# EAGLE design TEENSY AUDIO BOARDS (EAGLE 9.4.1)

## Sheet 1 of 2: IO Conditioning
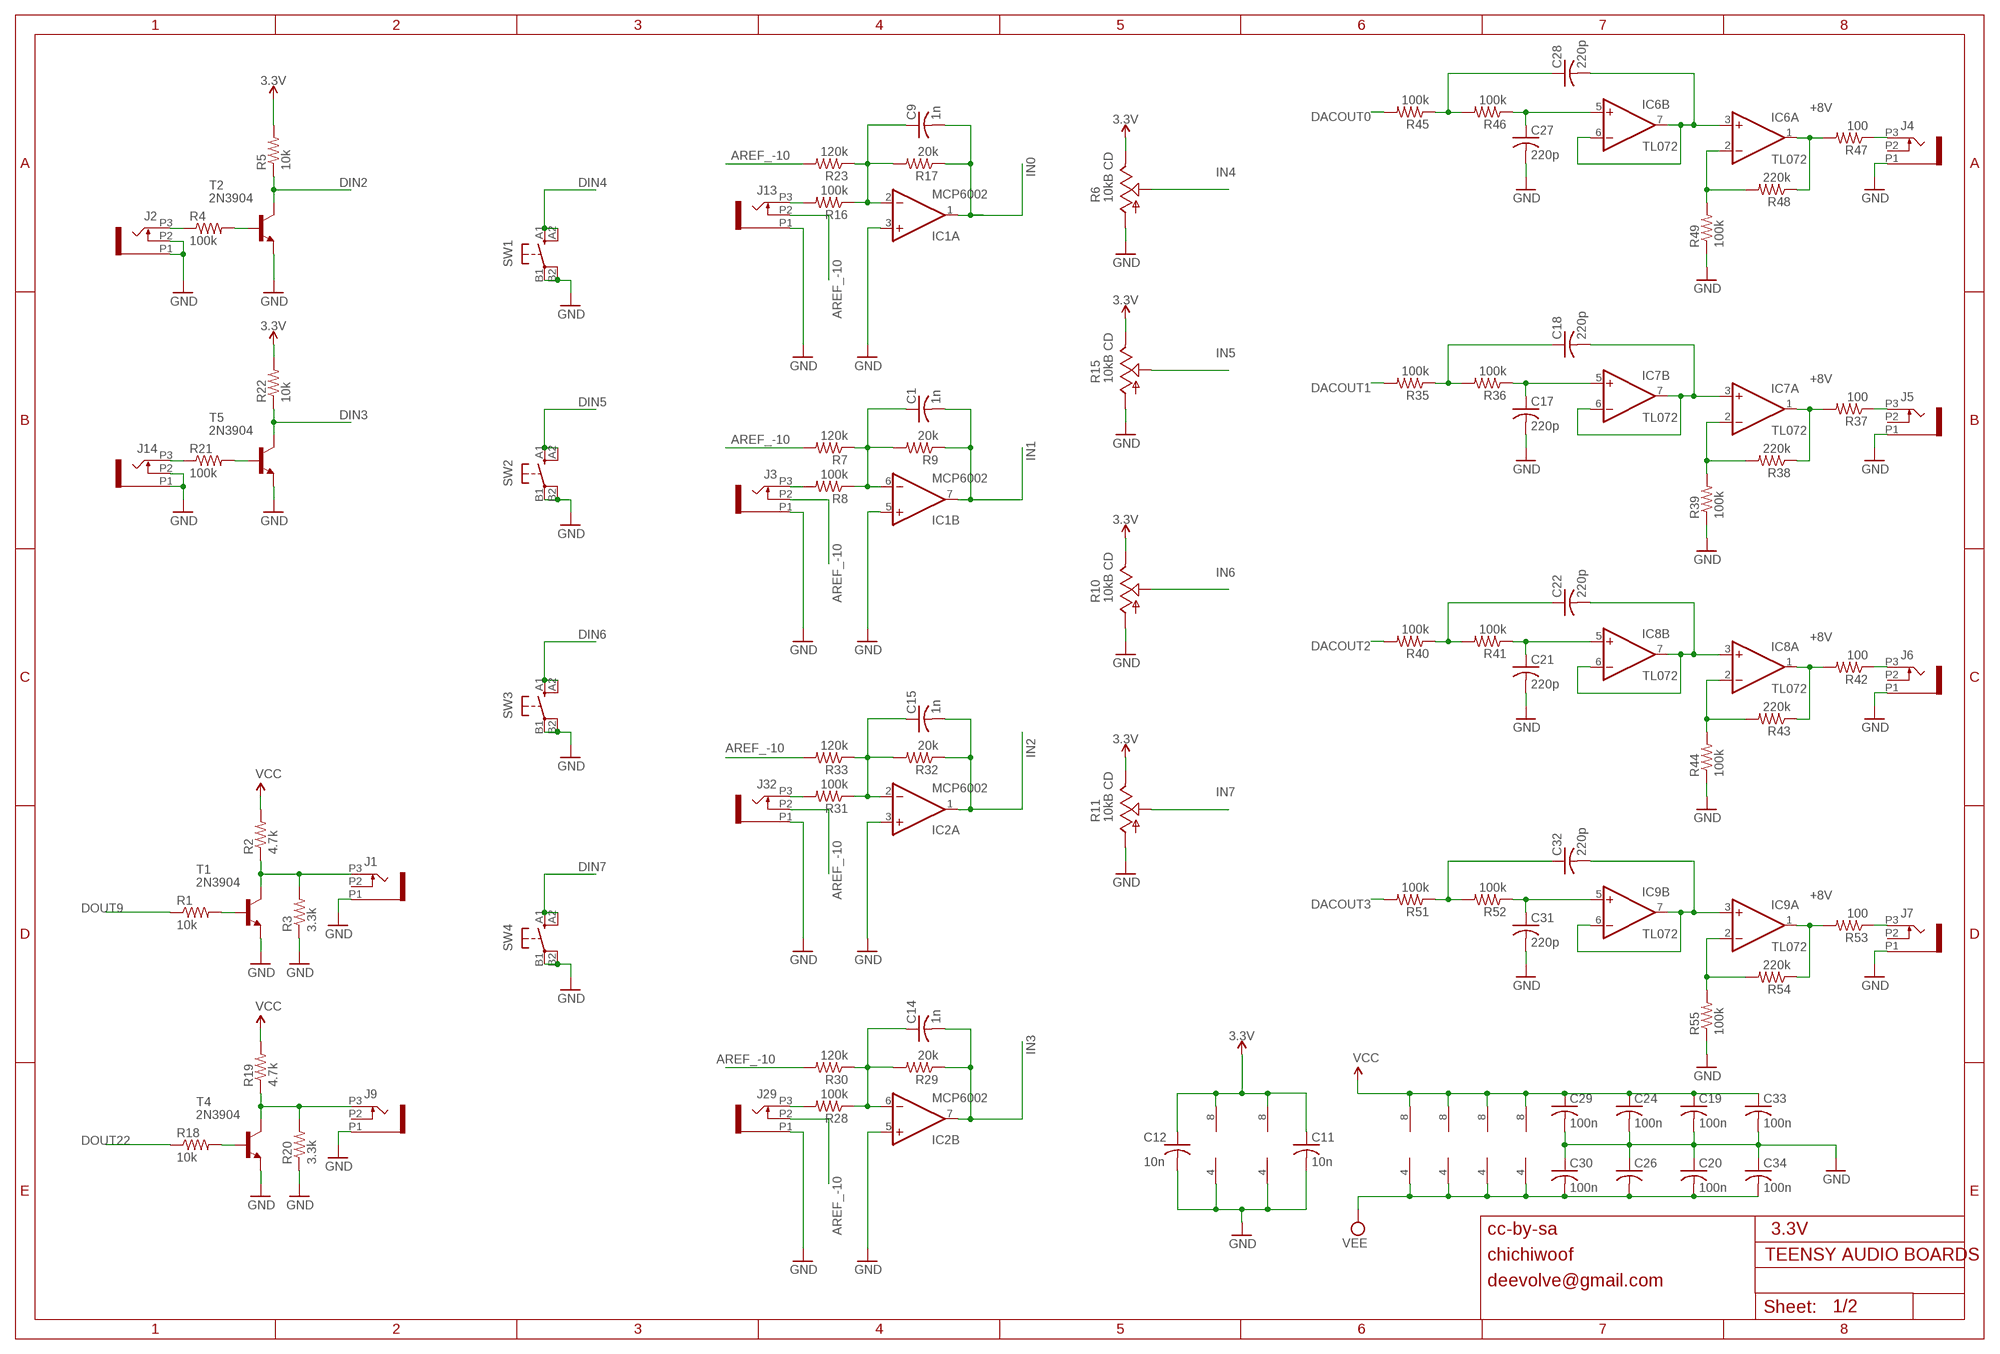
[diagram p0: schematic, sheet 1]

### Parts
C1  1n  C-US050-025X075  [C050-025X075]
C9  1n  C-US050-025X075  [C050-025X075]
C11  10n  C-US050-025X075  [C050-025X075]
C12  10n  C-US050-025X075  [C050-025X075]
C14  1n  C-US050-025X075  [C050-025X075]
C15  1n  C-US050-025X075  [C050-025X075]
C17  220p  C-US050-025X075  [C050-025X075]
C18  220p  C-US050-025X075  [C050-025X075]
C19  100n  C-US050-025X075  [C050-025X075]
C20  100n  C-US050-025X075  [C050-025X075]
C21  220p  C-US050-025X075  [C050-025X075]
C22  220p  C-US050-025X075  [C050-025X075]
C24  100n  C-US050-025X075  [C050-025X075]
C26  100n  C-US050-025X075  [C050-025X075]
C27  220p  C-US050-025X075  [C050-025X075]
C28  220p  C-US050-025X075  [C050-025X075]
C29  100n  C-US050-025X075  [C050-025X075]
C30  100n  C-US050-025X075  [C050-025X075]
C31  220p  C-US050-025X075  [C050-025X075]
C32  220p  C-US050-025X075  [C050-025X075]
C33  100n  C-US050-025X075  [C050-025X075]
C34  100n  C-US050-025X075  [C050-025X075]
IC1  MCP6002  TL072D  [SO08]
IC2  MCP6002  TL072D  [SO08]
IC6  TL072  TL072D  [SO08]
IC7  TL072  TL072D  [SO08]
IC8  TL072  TL072D  [SO08]
IC9  TL072  TL072D  [SO08]
J1  PJ301_THONKICONN6  [WQP_PJ_301M6]
J2  PJ301_THONKICONN6  [WQP_PJ_301M6]
J3  PJ301_THONKICONN6  [WQP_PJ_301M6]
J4  PJ301_THONKICONN6  [WQP_PJ_301M6]
J5  PJ301_THONKICONN6  [WQP_PJ_301M6]
J6  PJ301_THONKICONN6  [WQP_PJ_301M6]
J7  PJ301_THONKICONN6  [WQP_PJ_301M6]
J9  PJ301_THONKICONN6  [WQP_PJ_301M6]
J13  PJ301_THONKICONN6  [WQP_PJ_301M6]
J14  PJ301_THONKICONN6  [WQP_PJ_301M6]
J29  PJ301_THONKICONN6  [WQP_PJ_301M6]
J32  PJ301_THONKICONN6  [WQP_PJ_301M6]
R1  10k  R-US_0204/7  [0204/7]
R2  4.7k  R-US_0204/7  [0204/7]
R3  3.3k  R-US_0204/7  [0204/7]
R4  100k  R-US_0204/7  [0204/7]
R5  10k  R-US_0204/7  [0204/7]
R6  10kB CD  POT_USVERTICAL_PS  [ALPS_POT_VERTICAL_PS]
R7  120k  R-US_0204/7  [0204/7]
R8  100k  R-US_0204/7  [0204/7]
R9  20k  R-US_0204/7  [0204/7]
R10  10kB CD  POT_USVERTICAL_PS  [ALPS_POT_VERTICAL_PS]
R11  10kB CD  POT_USVERTICAL_PS  [ALPS_POT_VERTICAL_PS]
R15  10kB CD  POT_USVERTICAL_PS  [ALPS_POT_VERTICAL_PS]
R16  100k  R-US_0204/7  [0204/7]
R17  20k  R-US_0204/7  [0204/7]
R18  10k  R-US_0204/7  [0204/7]
R19  4.7k  R-US_0204/7  [0204/7]
R20  3.3k  R-US_0204/7  [0204/7]
R21  100k  R-US_0204/7  [0204/7]
R22  10k  R-US_0204/7  [0204/7]
R23  120k  R-US_0204/7  [0204/7]
R28  100k  R-US_0204/7  [0204/7]
R29  20k  R-US_0204/7  [0204/7]
R30  120k  R-US_0204/7  [0204/7]
R31  100k  R-US_0204/7  [0204/7]
R32  20k  R-US_0204/7  [0204/7]
R33  120k  R-US_0204/7  [0204/7]
R35  100k  R-US_0204/7  [0204/7]
R36  100k  R-US_0204/7  [0204/7]
R37  100  R-US_0204/7  [0204/7]
R38  220k  R-US_0204/7  [0204/7]
R39  100k  R-US_0204/7  [0204/7]
R40  100k  R-US_0204/7  [0204/7]
R41  100k  R-US_0204/7  [0204/7]
R42  100  R-US_0204/7  [0204/7]
R43  220k  R-US_0204/7  [0204/7]
R44  100k  R-US_0204/7  [0204/7]
R45  100k  R-US_0204/7  [0204/7]
R46  100k  R-US_0204/7  [0204/7]
R47  100  R-US_0204/7  [0204/7]
R48  220k  R-US_0204/7  [0204/7]
R49  100k  R-US_0204/7  [0204/7]
R51  100k  R-US_0204/7  [0204/7]
R52  100k  R-US_0204/7  [0204/7]
R53  100  R-US_0204/7  [0204/7]
R54  220k  R-US_0204/7  [0204/7]
R55  100k  R-US_0204/7  [0204/7]
SW1  D6R  [D6R]
SW2  D6R  [D6R]
SW3  D6R  [D6R]
SW4  D6R  [D6R]
T1  2N3904  [TO92]
T2  2N3904  [TO92]
T4  2N3904  [TO92]
T5  2N3904  [TO92]

### Nets
3.3V [+3V3]: C11.1 C12.1 IC1.8(P:V+) IC2.8(P:V+) R5.2 R6.P$1(E) R10.P$1(E) R11.P$1(E) R15.P$1(E) R22.2 ; also sheet 2
AREF_-10 [-10V]: J3.P2 J13.P2 J29.P2 J32.P2 R7.2 R23.2 R30.2 R33.2 ; also sheet 2
DACOUT0: R45.2 ; also sheet 2
DACOUT1: R35.2 ; also sheet 2
DACOUT2: R40.2 ; also sheet 2
DACOUT3: R51.2 ; also sheet 2
DIN2: R5.1 T2.1(C) ; also sheet 2
DIN3: R22.1 T5.1(C) ; also sheet 2
DIN4: SW1.A1(S) SW1.A2(S1) ; also sheet 2
DIN5: SW2.A1(S) SW2.A2(S1) ; also sheet 2
DIN6: SW3.A1(S) SW3.A2(S1) ; also sheet 2
DIN7: SW4.A1(S) SW4.A2(S1) ; also sheet 2
DOUT9: R1.1 ; also sheet 2
DOUT22: R18.1 ; also sheet 2
GND [GND]: C11.2 C12.2 C17.2 C19.2 C20.1 C21.2 C24.2 C26.1 C27.2 C29.2 C30.1 C31.2 C33.2 C34.1 IC1.3(A:+IN) IC1.4(P:V-) IC1.5(B:+IN) IC2.3(A:+IN) IC2.4(P:V-) IC2.5(B:+IN) J1.P1 J2.P1 J2.P2 J3.P1 J4.P1 J5.P1 J6.P1 J7.P1 J9.P1 J13.P1 J14.P1 J14.P2 J29.P1 J32.P1 R3.1 R6.P$3(A) R10.P$3(A) R11.P$3(A) R15.P$3(A) R20.1 R39.1 R44.1 R49.1 R55.1 SW1.B1(P) SW1.B2(P1) SW2.B1(P) SW2.B2(P1) SW3.B1(P) SW3.B2(P1) SW4.B1(P) SW4.B2(P1) T1.3(E) T2.3(E) T4.3(E) T5.3(E) ; also sheet 2
IN0: C9.2 IC1.1(A:OUT) R17.1 ; also sheet 2
IN1: C1.2 IC1.7(B:OUT) R9.1 ; also sheet 2
IN2: C15.2 IC2.1(A:OUT) R32.1 ; also sheet 2
IN3: C14.2 IC2.7(B:OUT) R29.1 ; also sheet 2
IN4: R6.P$2(S) ; also sheet 2
IN5: R15.P$2(S) ; also sheet 2
IN6: R10.P$2(S) ; also sheet 2
IN7: R11.P$2(S) ; also sheet 2
N$1: R1.2 T1.2(B)
N$2: J1.P3 R2.1 R3.2 T1.1(C)
N$5: J3.P3 R8.2
N$6: J13.P3 R16.2
N$9: C1.1 IC1.6(B:-IN) R7.1 R8.1 R9.2
N$11: C9.1 IC1.2(A:-IN) R16.1 R17.2 R23.1
N$12: R18.2 T4.2(B)
N$13: J9.P3 R19.1 R20.2 T4.1(C)
N$16: J14.P3 R21.1
N$17: R21.2 T5.2(B)
N$22: J4.P3 R47.1
N$28: C28.2 IC6.3(A:+IN) IC6.6(B:-IN) IC6.7(B:OUT)
N$29: C27.1 IC6.5(B:+IN) R46.1
N$30: C28.1 R45.1 R46.2
N$31: J29.P3 R28.2
N$32: C14.1 IC2.6(B:-IN) R28.1 R29.2 R30.1
N$34: J32.P3 R31.2
N$35: C15.1 IC2.2(A:-IN) R31.1 R32.2 R33.1
N$38: C18.2 IC7.3(A:+IN) IC7.6(B:-IN) IC7.7(B:OUT)
N$39: C17.1 IC7.5(B:+IN) R36.1
N$40: C18.1 R35.1 R36.2
N$41: IC7.2(A:-IN) R38.2 R39.2
N$42: IC7.1(A:OUT) R37.2 R38.1
N$43: IC6.2(A:-IN) R48.2 R49.2
N$44: IC6.1(A:OUT) R47.2 R48.1
N$49: C22.2 IC8.3(A:+IN) IC8.6(B:-IN) IC8.7(B:OUT)
N$50: C21.1 IC8.5(B:+IN) R41.1
N$51: C22.1 R40.1 R41.2
N$52: IC8.2(A:-IN) R43.2 R44.2
N$53: IC8.1(A:OUT) R42.2 R43.1
N$54: C32.2 IC9.3(A:+IN) IC9.6(B:-IN) IC9.7(B:OUT)
N$55: C31.1 IC9.5(B:+IN) R52.1
N$57: J2.P3 R4.1
N$58: C32.1 R51.1 R52.2
N$59: IC9.2(A:-IN) R54.2 R55.2
N$60: IC9.1(A:OUT) R53.2 R54.1
N$66: R4.2 T2.2(B)
UNI_OUT1: J6.P3 R42.1
UNI_OUT2: J7.P3 R53.1
UNI_OUT3: J5.P3 R37.1
VCC [VCC]: C19.1 C24.1 C29.1 C33.1 IC6.8(P:V+) IC7.8(P:V+) IC8.8(P:V+) IC9.8(P:V+) R2.2 R19.2 ; also sheet 2
VEE [VEE]: C20.2 C26.2 C30.2 C34.2 IC6.4(P:V-) IC7.4(P:V-) IC8.4(P:V-) IC9.4(P:V-) ; also sheet 2
Unconnected: J1.P2 J4.P2 J5.P2 J6.P2 J7.P2 J9.P2

### Notes on the sheet
- +8V
- +8V
- +8V
- +8V
- cc-by-sa | 3.3V
- chichiwoof
- deevolve@gmail.com

## Sheet 2 of 2: Power and Arduino Pins
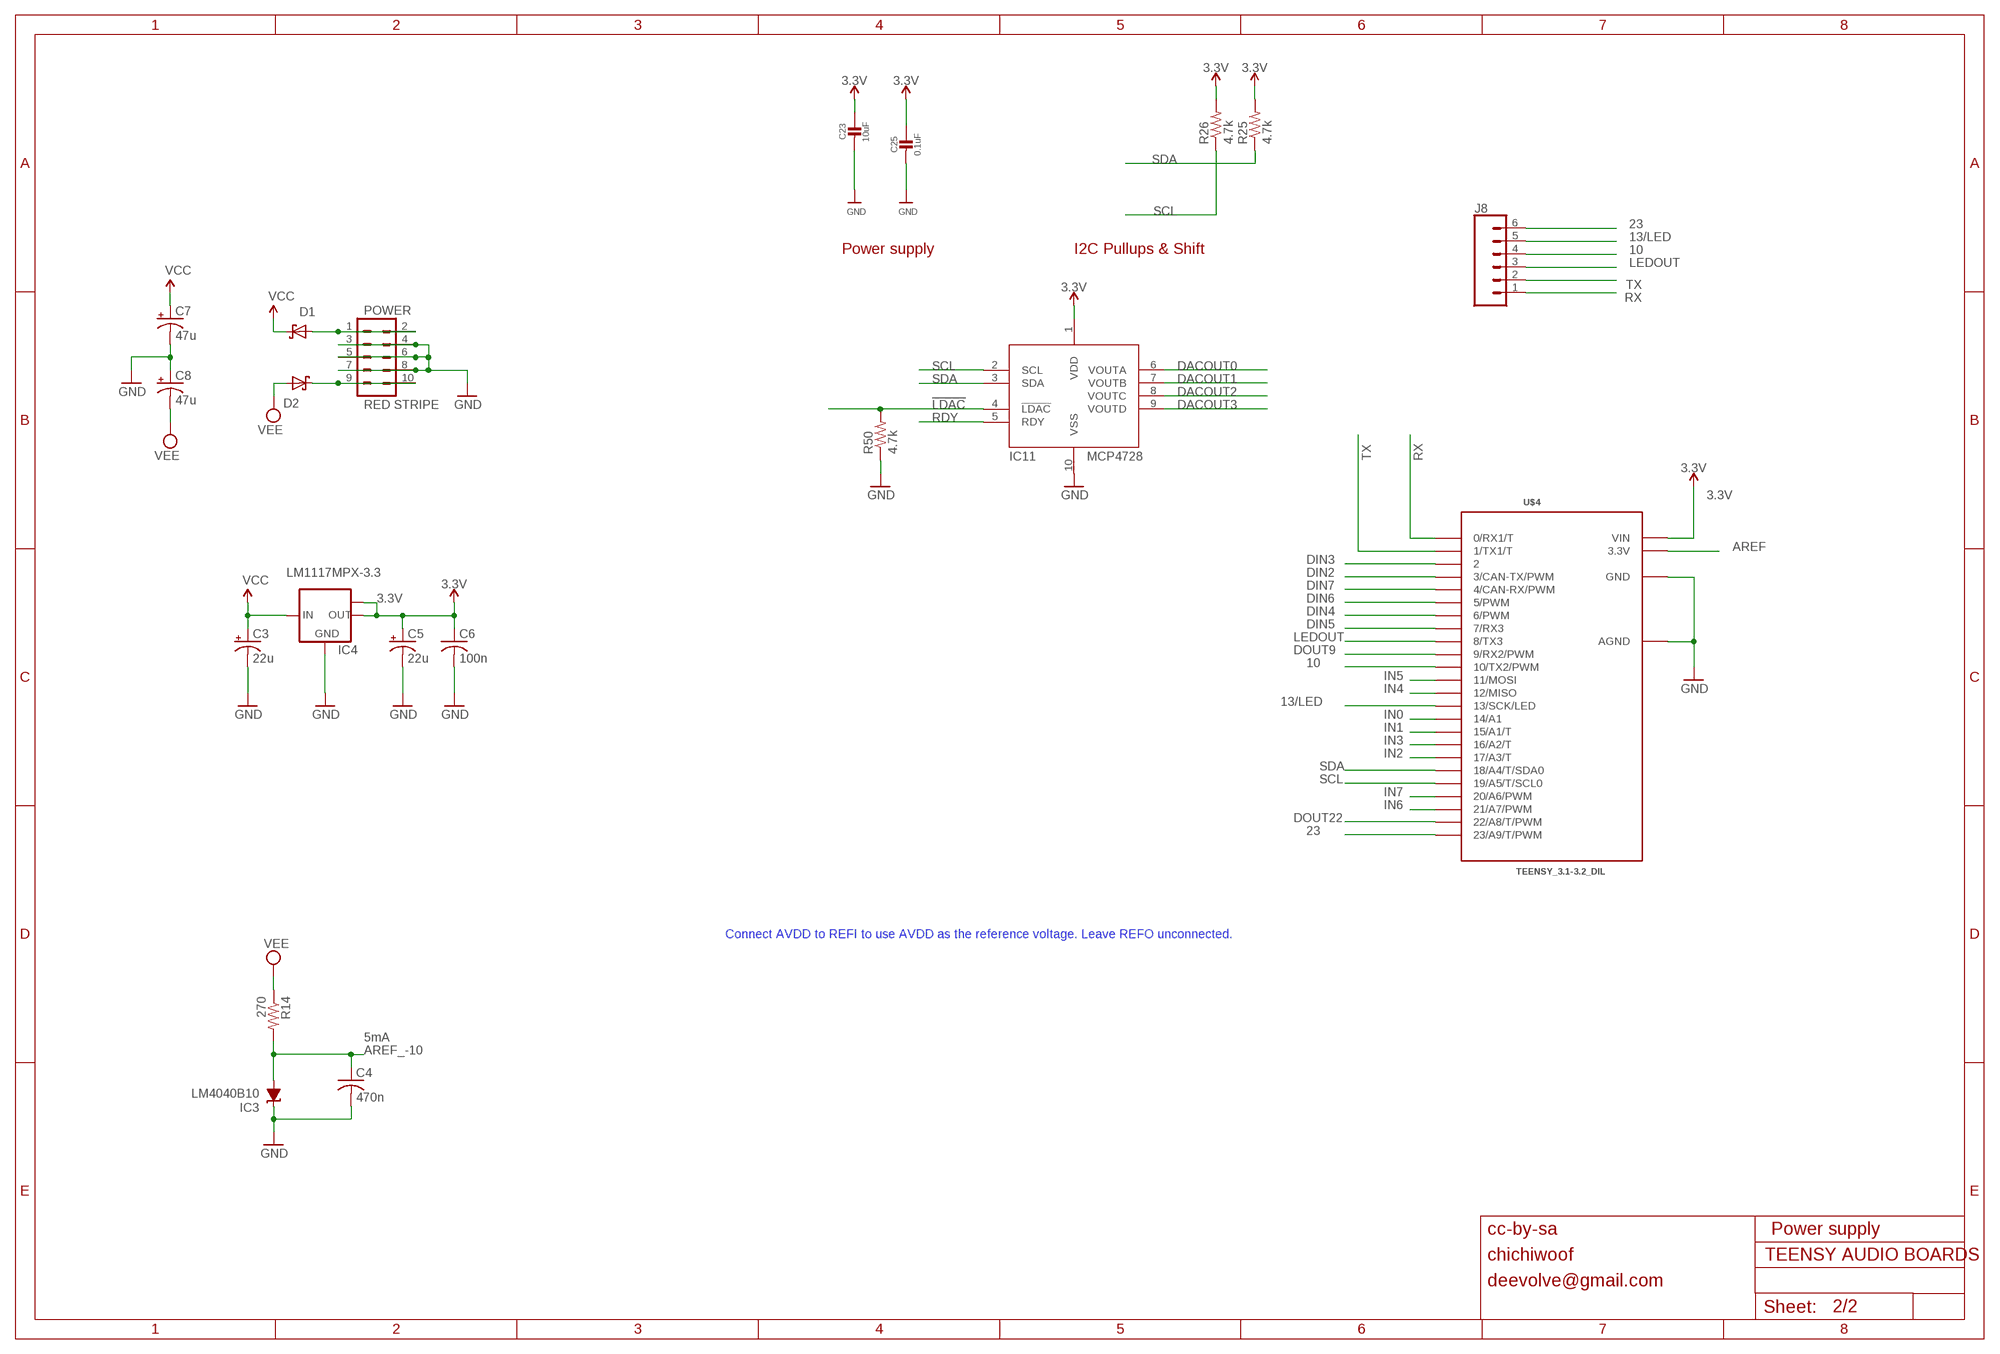
[diagram p1: schematic, sheet 2]

### Parts
C3  22u  CPOL-USE2.5-7  [E2,5-7]
C4  470n  C-US050-025X075  [C050-025X075]
C5  22u  CPOL-USE2.5-7  [E2,5-7]
C6  100n  C-US050-025X075  [C050-025X075]
C7  47u  CPOL-USE2.5-7  [E2,5-7]
C8  47u  CPOL-USE2.5-7  [E2,5-7]
C23  10uF  CAP_CERAMIC0805-NOOUTLINE  [0805-NO]
C25  0.1uF  CAP_CERAMIC0603_NO  [0603-NO]
D1  1N5819  SCHOTTKY-DIODEDO41  [DO41-10]
D2  1N5819  SCHOTTKY-DIODEDO41  [DO41-10]
IC3  LM4040B10  LM4041B12DBZ  [DBZ_R-PDSO-G3]
IC4  LM1117MPX-3.3  [SOT223]
IC11  MCP4728  [MSOP10]
J8  CONN_06SILK_FEMALE_PTH  [1X06]
POWER  RED STRIPE  M05X2PTH  [AVR_ICSP]
R14  270  R-US_0204/7  [0204/7]
R25  4.7k  R-US_0204/7  [0204/7]
R26  4.7k  R-US_0204/7  [0204/7]
R50  4.7k  R-US_0204/7  [0204/7]
U$4  TEENSY_3.1-3.2_DIL  [TEENSY_3.0-3.2&LC_DIL]

### Nets
3.3V [+3V3]: C5.+ C6.1 C23.1 C25.1 IC4.2(OUT) IC4.TAB(OUT1) IC11.1(VDD) R25.2 R26.2 U$4.VIN ; also sheet 1
10: J8.4 U$4.10(10/TX2/PWM)
13/LED: J8.5 U$4.13(13/SCK/LED)
23: J8.6 U$4.23/A9(23/A9/T/PWM)
!LDAC: IC11.4(!LDAC) R50.2
+12 [VCC]: D1.A POWER.1 POWER.2
-12 [VEE]: D2.C POWER.9 POWER.10
AREF: U$4.3.3V
AREF_-10 [-10V]: C4.1 IC3.2(A) R14.2 ; also sheet 1
DACOUT0: IC11.6(VOUTA) ; also sheet 1
DACOUT1: IC11.7(VOUTB) ; also sheet 1
DACOUT2: IC11.8(VOUTC) ; also sheet 1
DACOUT3: IC11.9(VOUTD) ; also sheet 1
DIN2: U$4.3(3/CAN-TX/PWM) ; also sheet 1
DIN3: U$4.2 ; also sheet 1
DIN4: U$4.6(6/PWM) ; also sheet 1
DIN5: U$4.7(7/RX3) ; also sheet 1
DIN6: U$4.5(5/PWM) ; also sheet 1
DIN7: U$4.4(4/CAN-RX/PWM) ; also sheet 1
DOUT9: U$4.9(9/RX2/PWM) ; also sheet 1
DOUT22: U$4.22/A8(22/A8/T/PWM) ; also sheet 1
GND [GND]: C3.- C4.2 C5.- C6.2 C7.- C8.+ C23.2 C25.2 IC3.1(C) IC4.1(GND) IC11.10(VSS) POWER.3 POWER.4 POWER.5 POWER.6 POWER.7 POWER.8 R50.1 U$4.AGND U$4.GND ; also sheet 1
IN0: U$4.14/A0(14/A1) ; also sheet 1
IN1: U$4.15/A1(15/A1/T) ; also sheet 1
IN2: U$4.17/A3(17/A3/T) ; also sheet 1
IN3: U$4.16/A2(16/A2/T) ; also sheet 1
IN4: U$4.12(12/MISO) ; also sheet 1
IN5: U$4.11(11/MOSI) ; also sheet 1
IN6: U$4.21/A7(21/A7/PWM) ; also sheet 1
IN7: U$4.20/A6(20/A6/PWM) ; also sheet 1
LEDOUT: J8.3 U$4.8(8/TX3)
RDY: IC11.5(RDY)
RX: J8.1 U$4.0(0/RX1/T)
SCL: IC11.2(SCL) R26.1 U$4.19/A5(19/A5/T/SCL0)
SDA: IC11.3(SDA) R25.1 U$4.18/A4(18/A4/T/SDA0)
TX: J8.2 U$4.1(1/TX1/T)
VCC [VCC]: C3.+ C7.+ D1.C IC4.3(IN) ; also sheet 1
VEE [VEE]: C8.- D2.A R14.1 ; also sheet 1

### Notes on the sheet
- Power supply | I2C Pullups & Shift
- Connect AVDD to REFI to use AVDD as the reference voltage. Leave REFO unconnected.
- 5mA
- cc-by-sa | Power supply
- chichiwoof
- deevolve@gmail.com

## Library data of the parts
C1 C4 C6 C9 C11 C12 C14 C15 C17-C22 C24 C26-C34 = rcl:C-US: CAPACITOR, American symbol; SPICEPREFIX: C
C3 C5 C7 C8 = rcl:CPOL-US: POLARIZED CAPACITOR, American symbol; SPICEPREFIX: C
C23 C25 = microbuilder:CAP_CERAMIC: Ceramic Capacitors For new designs, use the packages preceded by an '_' character since they are more reliable: The following footprints should be used on most boards: _0402 - Standard footprint for regular board layouts _0603 - Standard footprint for regular board layouts _0805 - Standard footprint for regular board layouts _1206 - Standard footprint for regular board layouts For extremely tight-pitch boards where space is at a premium, the following 'micro-pitch' footprints can be used (smaller pads, no silkscreen outline, etc.): _0402MP - Micro-pitch footprint for very dense/compact boards _0603MP - Micro-pitch footprint for very dense/compact boards _0805MP - Micro-pitch footprint for very dense/compact boards _1206MP - Micro-pitch footprint for very dense/compact boards
D1 D2 = adafruit:SCHOTTKY-DIODE: Schottky Diode
IC1 IC2 IC6-IC9 = linear:TL072: OP AMP
IC3 = texas:LM4041: PRECISION MICROPOWER SHUNT VOLTAGE REFERENCE Source: http://focus.ti.com/lit/ds/slcs146e/slcs146e.pdf
IC4 = lm1117:LM1117MPX-*
IC11 = microbuilder:MCP4728
J1-J7 J9 J13 J14 J29 J32 = og-pj301_variations:PJ301_THONKICONN
J8 = SparkFun-Connectors:CONN_06: Multi connection point. Often used as Generic Header-pin footprint for 0.1 inch spaced/style header connections On any of the 0.1 inch spaced packages, you can populate with these: Break Away Headers - Straight <https://www.sparkfun.com/products/116> (PRT-00116) Break Away Male Headers - Right Angle <https://www.sparkfun.com/products/553> (PRT-00553) Female Headers <https://www.sparkfun.com/products/115> (PRT-00115) Break Away Headers - Machine Pin <https://www.sparkfun.com/products/117> (PRT-00117) Break Away Female Headers - Swiss Machine Pin <https://www.sparkfun.com/products/743> (PRT-00743) Arduino Stackable Header - 6 Pin <https://www.sparkfun.com/products/9280> (PRT-09280) For SCREWTERMINALS and SPRING TERMINALS visit here: Screw Terimnals on SparkFun.com <https://www.sparkfun.com/search/results?term=Screw+Terminals> (5mm/3.5mm/2.54mm spacing) This device is also useful as a general connection point to wire up your design to another part of your project. Our various solder wires solder well into these plated through hole pads. Hook-Up Wire - Assortment (Stranded, 22 AWG) <https://www.sparkfun.com/products/11375> (PRT-11375) Hook-Up Wire - Assortment (Solid Core, 22 AWG) <https://www.sparkfun.com/products/11367> (PRT-11367) View the entire wire category on our website here <https://www.sparkfun.com/categories/141>; PROD_ID: CONN-08437
POWER = og-header:M05X2: Header 5x2 Standard 10-pin dual row 0.1" header. Commonly used with AVR-ISP. Use with Spark Fun Electronics SKU: PRT-00778
R1-R5 R7-R9 R14 R16-R23 R25 R26 R28-R33 R35-R55 = rcl:R-US_: RESISTOR, American symbol; SPICEPREFIX: R
R6 R10 R11 R15 = pot-alps:POT_US
SW1-SW4 = og-switch:D6R: C&K D6R
T1 T2 T4 T5 = transistor:2N3904: NPN TRANSISTOR
U$4 = Teensy_3_and_LC_Series_Boards_v1.4:TEENSY_3.1-3.2_DIL: Teensy 3.1 or 3.2 in a DIL Layout.

## Net classes
0 default: width 0.254 mm, clearance 0.203 mm
1 GND: width 0.406 mm, clearance 0.254 mm to class 0, clearance 0.254 mm
2 +3V3: width 0.356 mm, clearance 0.152 mm to class 0, clearance 0.254 mm
3 -10V: width 0.356 mm, clearance 0.152 mm to class 0, clearance 0.254 mm
4 VCC: width 0.457 mm, clearance 0.152 mm to class 0, clearance 0.254 mm
5 VEE: width 0.457 mm, clearance 0.152 mm to class 0, clearance 0.254 mm

## Board
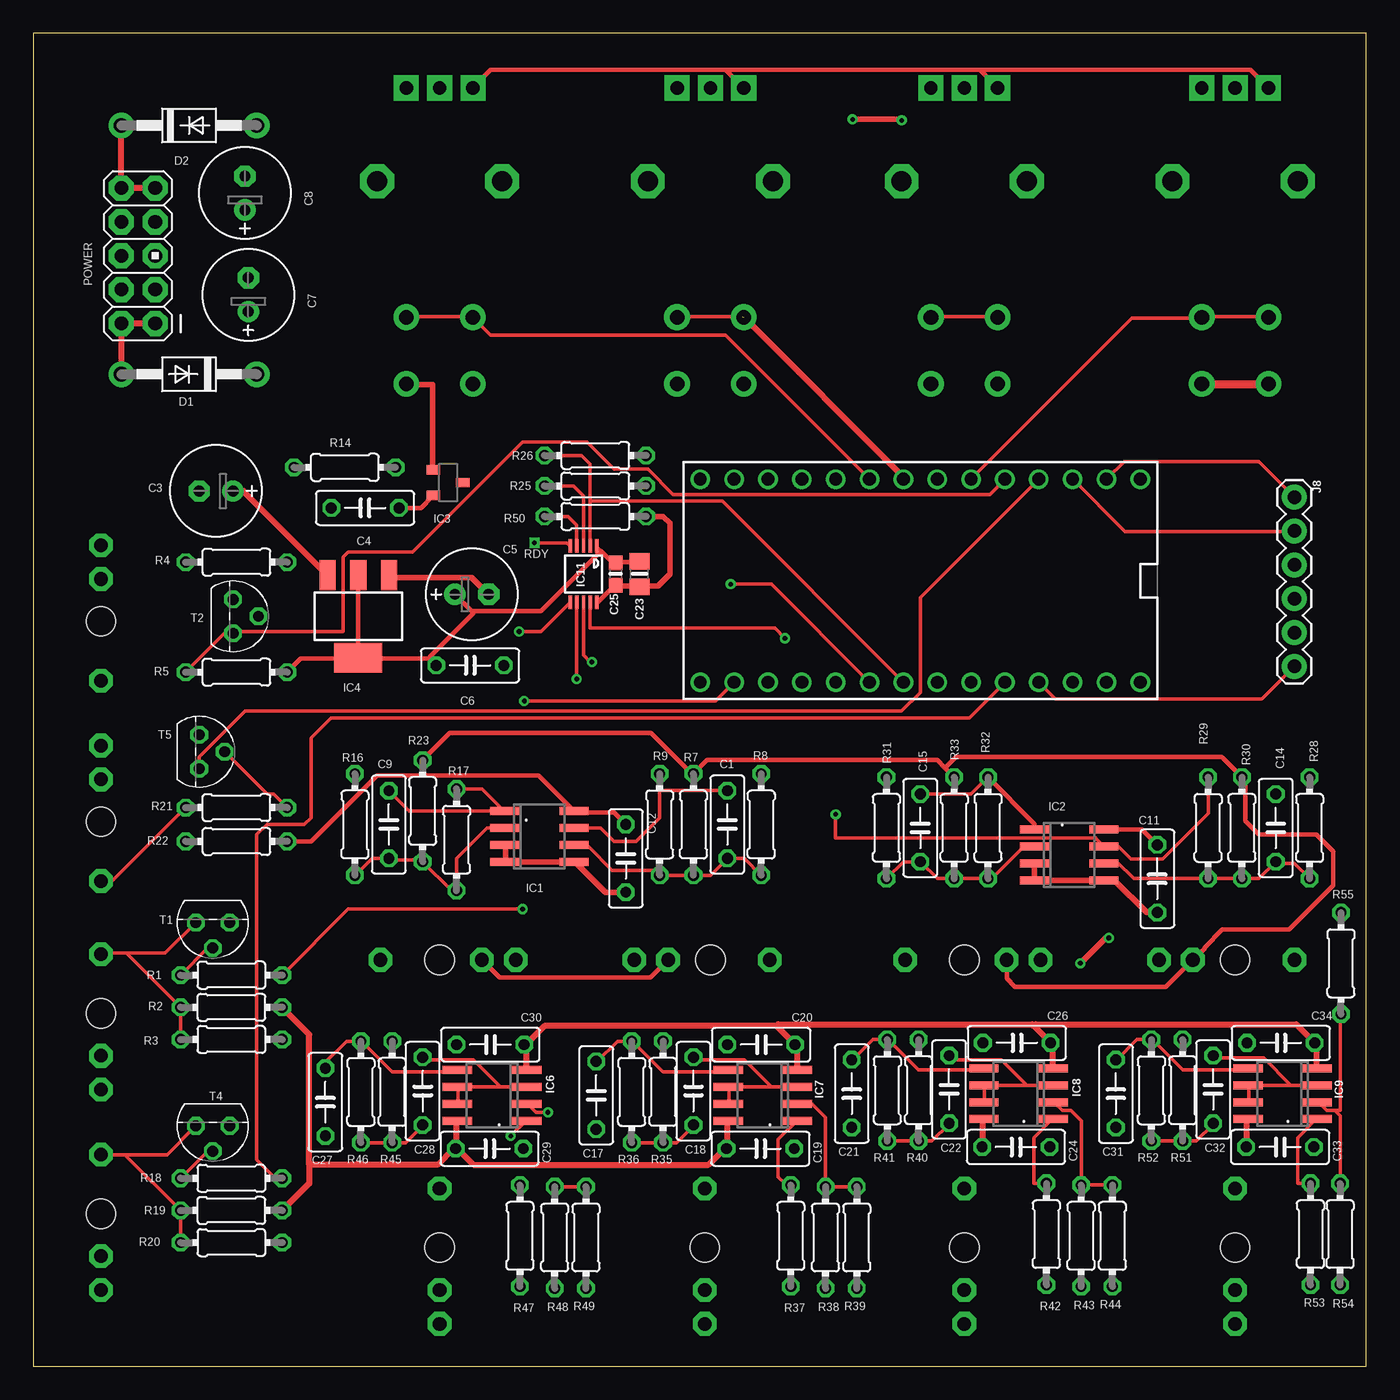
[diagram p2: board, top side]
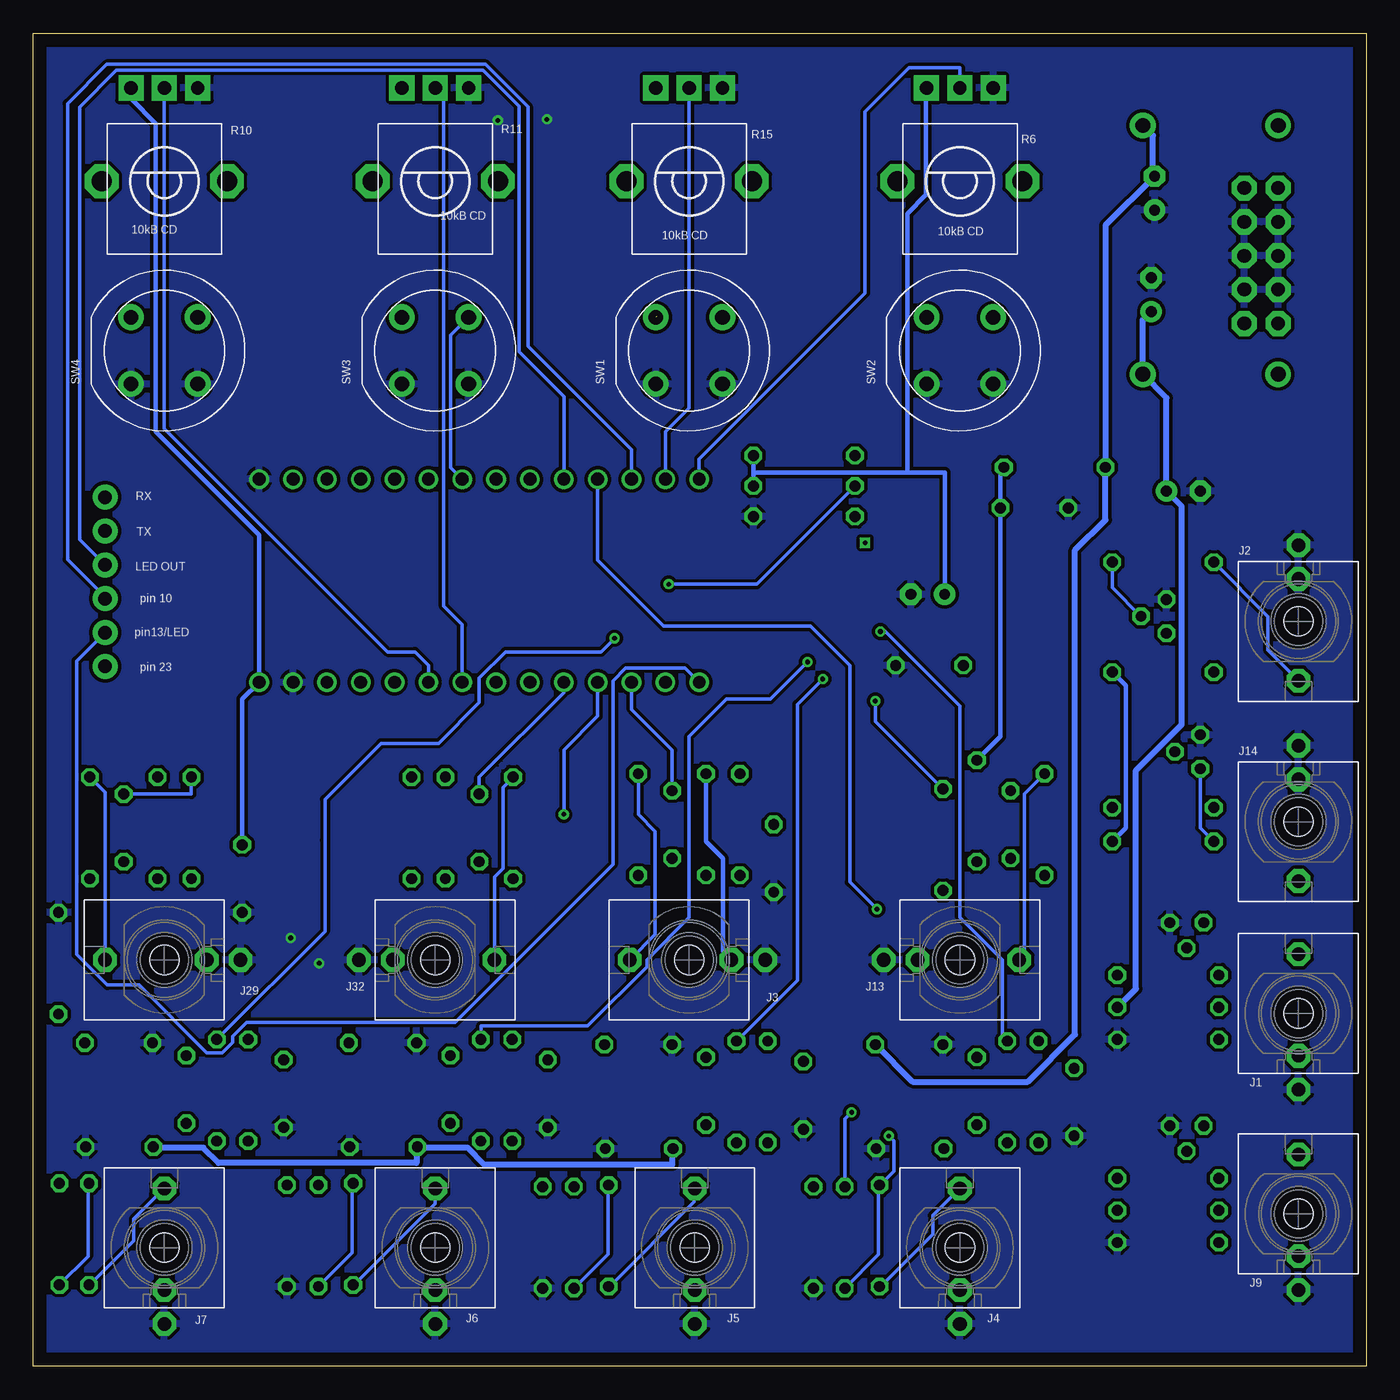
[diagram p3: board, bottom side, seen from below]

Size 100 x 100 mm. Coordinates in mm from the lower left corner, seen from the top.
Outline: 0,0 100,0 100,100 0,100 0,0
Copper layers (1*16): Top 0.035mm / dielectric 1.5mm / Bottom 0.035mm
Design rules "default": minimum track width 6mil, minimum drill 0.35mm, track to track 6mil, track to pad 6mil, pad to pad 6mil, via to via 6mil, smd to smd 6mil, copper to edge 40mil, drill to drill 6mil, minimum pad ring 10mil, minimum via ring 8mil, stop-mask expansion 4mil, vias tented up to drill 0mil, thermal gap 10mil

### Footprints (pad centres in the part's own frame; a part is rotated, then mirrored left to right if it is on the bottom)
C050-025X075 = drill 0.813 octagon: 1 -2.54,0; 2 2.54,0
E2,5-7 = drill 0.813 pad 1.6: + -1.27,0 | drill 0.813 pad 1.6 octagon: - 1.27,0
0805-NO = smd 1.24 x 1.5: 1 -0.95,0; 2 0.95,0
0603-NO = smd 1.075 x 1: 1 -0.85,0; 2 0.85,0
DO41-10 = drill 1.118 pad 1.93: A 5.08,0; C -5.08,0
SO08 = smd 0.6 x 2.2: 1 -1.905,-2.6; 2 -0.635,-2.6; 3 0.635,-2.6; 4 1.905,-2.6; 5 1.905,2.6; 6 0.635,2.6; 7 -0.635,2.6; 8 -1.905,2.6
DBZ_R-PDSO-G3 = smd 0.7 x 1: 1 -0.95,-1.1; 2 0.95,-1.1; 3 0,1.1
SOT223 = smd 1.219 x 2.235: 1 -2.311,-3.099; 2 0,-3.099; 3 2.311,-3.099 | smd 3.6 x 2.2: TAB 0,3.099
MSOP10 = smd 0.25 x 1: 1 -1,-2.113; 2 -0.5,-2.113; 3 0,-2.113; 4 0.5,-2.113; 5 1,-2.113; 6 1,2.113; 7 0.5,2.113; 8 0,2.113; 9 -0.5,2.113; 10 -1,2.113
WQP_PJ_301M6 = drill 1.016 pad 1.778 octagon: P1 0,-5.715; P2 0,-3.175; P3 0,4.445 | hole 2.2: 0,0
1X06 = drill 1.016 pad 1.88: 1 0,0; 2 2.54,0; 3 5.08,0; 4 7.62,0; 5 10.16,0; 6 12.7,0
AVR_ICSP = drill 1.016 pad 1.88 octagon: 1 -1.27,5.08; 2 1.27,5.08; 3 -1.27,2.54; 4 1.27,2.54; 5 -1.27,0; 6 1.27,0; 7 -1.27,-2.54; 8 1.27,-2.54; 9 -1.27,-5.08; 10 1.27,-5.08
0204/7 = drill 0.813 octagon: 1 -3.81,0; 2 3.81,0
ALPS_POT_VERTICAL_PS = drill 1 pad 1.88 square: P$1 -2.5,7; P$2 0,7; P$3 2.5,7 | drill 1.5 pad 2.54 octagon: P$4 -4.7,0; P$5 4.7,0
D6R = drill 1.1 pad 1.93: A1 -2.5,2.5; A2 2.5,2.5; B1 -2.5,-2.5; B2 2.5,-2.5
TO92 = drill 0.813 octagon: 1 1.27,0; 2 0,1.905; 3 -1.27,0
TEENSY_3.0-3.2&LC_DIL = drill 0.965: 0 -7.62,13.97; 1 -7.62,11.43; 2 -7.62,8.89; 3 -7.62,6.35; 3.3V 7.62,11.43; 4 -7.62,3.81; 5 -7.62,1.27; 6 -7.62,-1.27; 7 -7.62,-3.81; 8 -7.62,-6.35; 9 -7.62,-8.89; 10 -7.62,-11.43; 11 -7.62,-13.97; 12 -7.62,-16.51; 13 7.62,-16.51; 14/A0 7.62,-13.97; 15/A1 7.62,-11.43; 16/A2 7.62,-8.89; 17/A3 7.62,-6.35; 18/A4 7.62,-3.81; 19/A5 7.62,-1.27; 20/A6 7.62,1.27; 21/A7 7.62,3.81; 22/A8 7.62,6.35; 23/A9 7.62,8.89; AGND 7.62,13.97; GND -7.62,16.51; VIN 7.62,16.51

### Placement (x,y rotation side)
C1  52.07,40.64 90 top
C3  13.72,65.66 180 top
C4  24.89,64.39 180 top
C5  32.89,57.91 0 top
C6  32.77,52.58 0 top
C7  16.13,80.39 90 top
C8  15.88,88.01 90 top
C9  26.67,40.64 90 top
C11  84.33,36.58 270 top
C12  44.45,38.1 270 top
C14  93.22,40.39 90 top
C15  66.55,40.39 90 top
C17  42.23,20.32 270 top
C18  49.53,20.64 90 top
C19  54.55,16.32 0 top
C20  54.61,24.13 0 top
C21  61.4,20.45 270 top
C22  68.71,20.76 90 top
C23  45.47,59.44 270 top
C24  73.72,16.45 0 top
C25  43.69,59.44 270 top
C26  73.79,24.26 0 top
C27  21.91,19.81 270 top
C28  29.21,20.64 90 top
C29  34.23,16.32 0 top
C30  34.29,24.13 0 top
C31  81.22,20.45 270 top
C32  88.52,20.76 90 top
C33  93.54,16.45 0 top
C34  93.6,24.26 0 top
D1  11.68,74.42 180 top
D2  11.68,93.09 0 top
IC1  37.97,39.75 270 top
IC2  77.72,38.35 270 top
IC3  31.11,66.29 270 top
IC4  24.38,56.26 180 top
IC6  34.42,20.32 90 top
IC7  54.74,20.32 90 top
IC8  73.91,20.45 90 top
IC9  93.73,20.45 90 top
IC11  41.27,59.44 180 top
J1  5.08,26.46 0 bottom
J2  5.08,55.88 180 bottom
J3  50.8,30.48 90 bottom
J4  30.48,8.89 0 bottom
J5  50.38,8.89 0 bottom
J6  69.85,8.89 0 bottom
J7  90.17,8.89 0 bottom
J8  94.61,65.2 270 top
J9  5.08,11.43 0 bottom
J13  30.48,30.48 270 bottom
J14  5.08,40.85 180 bottom
J29  90.17,30.48 90 bottom
J32  69.85,30.48 270 bottom
POWER  7.87,83.31 180 top
R1  14.86,29.34 180 top
R2  14.86,26.92 0 top
R3  14.86,24.51 180 top
R4  15.24,60.33 0 top
R5  15.24,52.07 0 top
R6  30.48,88.9 0 bottom
R7  49.53,40.64 90 top
R8  54.61,40.64 90 top
R9  46.99,40.64 270 top
R10  90.17,88.9 0 bottom
R11  69.85,88.9 0 bottom
R14  23.37,67.44 0 top
R15  50.8,88.9 0 bottom
R16  24.13,40.64 90 top
R17  31.75,39.5 270 top
R18  14.86,14.1 180 top
R19  14.86,11.68 0 top
R20  14.86,9.27 180 top
R21  15.24,41.91 0 top
R22  15.24,39.37 0 top
R23  29.21,41.66 90 top
R25  42.16,66.04 0 top
R26  42.16,68.33 0 top
R28  95.76,40.39 90 top
R29  88.14,40.39 270 top
R30  90.68,40.39 90 top
R31  64.01,40.39 90 top
R32  71.63,40.39 270 top
R33  69.09,40.39 90 top
R35  47.24,20.57 90 top
R36  44.89,20.57 270 top
R37  56.83,9.78 90 top
R38  59.44,9.65 90 top
R39  61.79,9.65 90 top
R40  66.42,20.7 90 top
R41  64.07,20.7 270 top
R42  76.01,9.91 90 top
R43  78.61,9.78 90 top
R44  80.96,9.78 90 top
R45  26.92,20.57 90 top
R46  24.57,20.57 270 top
R47  36.51,9.78 90 top
R48  39.12,9.65 90 top
R49  41.47,9.65 90 top
R50  42.16,63.75 180 top
R51  86.23,20.7 90 top
R52  83.88,20.7 270 top
R53  95.82,9.91 90 top
R54  98.04,9.91 90 top
R55  98.11,30.23 270 top
SW1  50.8,76.2 0 bottom
SW2  30.48,76.2 0 bottom
SW3  69.85,76.2 0 bottom
SW4  90.17,76.2 0 bottom
T1  13.46,33.27 180 top
T2  14.99,56.26 270 top
T4  13.46,18.03 180 top
T5  12.45,46.1 270 top
U$4  66.55,58.93 270 top

### Tracks (layer width: path | path; a pad name or v marks a point on that pad's centre or on a via)
3.3V
  Top 0.254: 42.61,61.15 42.29,61.47 IC11.1
  Top 0.356: C12.1 43.56,41.53 40.77,41.53 40.64,41.66 IC1.8 37.91,44.32 25.78,44.32 20.83,39.37 R22.2 | IC4.TAB IC4.2 | 29.72,53.09 C6.1 | 29.72,53.09 24.51,53.09 IC4.TAB | C23.1 45.47,60.33 43.81,60.33 C25.1 43.69,60.33 43.43,60.33 42.61,61.15 38.1,56.64 33.02,56.64 | 33.02,56.64 32.89,56.64 C5.+ | 29.72,53.09 29.72,53.21 33.02,56.52 33.02,56.64 | R5.2 20.07,53.09 24.26,53.09 IC4.TAB | 51.94,97.28 34.29,97.28 33.02,96.01 R6.P$1 | 51.94,97.28 53.21,96.01 R15.P$1 | 71.06,97.22 70.99,97.28 51.94,97.28 | 71.06,97.22 72.26,96.01 R11.P$1 | R10.P$1 92.58,96.01 91.31,97.28 71.12,97.28 71.06,97.22 | C11.1 83.19,40.26 IC2.8
  Bottom 0.356: R22.2 18.03,40.39 18.03,51.05 R5.2 | R26.2 45.97,67.06 | 45.97,67.06 R25.2 | 34.42,67.06 31.62,67.06 C5.+ | 34.42,67.06 45.97,67.06 | C11.1 84.33,50.04 U$4.VIN 83.06,62.36 90.81,70.1 90.81,93.22 92.67,95.08 R10.P$1 | 34.42,67.06 34.42,86.49 33.02,87.88 33.02,95.89 R6.P$1
10
  Bottom 0.254: U$4.10 55.12,68.76 62.89,76.53 62.89,94.51 66.06,97.68 94.49,97.68 97.44,94.73 97.44,60.53 94.61,57.71 J8.4
13/LED
  Bottom 0.254: U$4.13 51.1,52.38 55.56,52.38 56.52,51.41 56.52,37.64 68.37,25.79 84.01,25.79 85.06,24.74 85.06,24.29 85.82,23.52 86.99,23.52 92.06,28.59 94.45,28.59 96.75,30.89 96.75,52.91 J8.5
23
  Top 0.254: U$4.23/A9 76.68,50.06 92.18,50.06 J8.6
!LDAC
  Top 0.254: R50.2 40.13,63.75 40.77,63.12 40.77,61.59 IC11.4
+12
  Top 0.457: POWER.1 POWER.2 D1.A
-12
  Top 0.457: POWER.9 POWER.10 D2.C
AREF_-10
  Top 0.356: C4.1 29.08,64.39 29.97,65.28 IC3.2 | R33.2 68.39,44.9 | 68.39,44.9 67.82,45.47 50.55,45.47 R7.2 49.4,44.45 46.35,47.5 31.24,47.5 R23.2 | 68.39,44.9 69.22,45.72 89.15,45.72 R30.2 90.93,43.94 90.93,40.89 91.95,39.88 96.27,39.88 97.54,38.61 97.54,36.07 94.24,32.77 89.22,32.77 87.88,31.43 87.88,31.36 J29.P2 84.96,28.45 73.66,28.45 73.03,29.08 J32.P2 | J3.P2 46.3,29.16 34.98,29.16 J13.P2
  Bottom 0.356: R23.2 27.43,47.24 C4.1 27.43,67.18 R14.2 | R7.2 49.53,39.37 48.26,38.1 48.26,31.11 J3.P2
DACOUT0  (via drill 0.35)
  Top 0.254: v36.45,55.12 38.1,55.12 40.26,57.28 IC11.6
  Bottom 0.254: v36.45,55.12 36.07,55.12 30.48,49.53 30.48,33.66 27.3,30.48 27.3,24.77 R45.2
DACOUT1  (via drill 0.35)
  Top 0.254: v40.77,51.56 40.77,57.28 IC11.7
  Bottom 0.254: v40.77,51.56 42.67,49.66 42.67,28.96 R35.2
DACOUT2  (via drill 0.35)
  Top 0.254: IC11.8 41.27,53.34 41.78,52.83 v41.91,52.83
  Bottom 0.254: v41.91,52.83 44.7,50.04 48.01,50.04 50.8,47.24 50.8,33.66 53.98,30.48 53.98,29.97 58.42,25.53 66.42,25.53 R40.2
DACOUT3  (via drill 0.35)
  Top 0.254: IC11.9 41.77,55.37 55.63,55.37 v56.39,54.61
  Bottom 0.254: R51.2 78.11,32.63 78.11,39.45 78.11,42.53 73.91,46.74 69.6,46.74 66.55,49.78 66.55,51.62 64.57,53.59 63.97,53.59 57.4,53.59 v56.39,54.61
DIN2
  Top 0.254: R5.1 14.35,54.99 T2.1 15.11,55.12 23.24,55.12 23.24,60.71 23.62,61.09 28.45,61.09 36.7,69.34 41.53,69.34 43.56,67.31 46.1,67.31 48.01,65.41 71.75,65.41 U$4.3
DIN3
  Top 0.254: U$4.2 66.55,57.66 66.55,50.56 65.14,49.15 15.88,49.15 12.45,45.72 T5.1
  Bottom 0.254: R22.1 12.45,40.39 T5.1
DIN4  (1 unrouted)
  Top 0.254: 53.21,78.74 48.39,78.74 SW1.A2
  Top 0.406: SW1.A1 65.28,66.72 U$4.6
DIN5
  Top 0.254: U$4.7 51.94,77.34 34.29,77.34 33.02,78.61 SW2.A1 32.89,78.74 28.07,78.74 SW2.A2
DIN6
  Top 0.254: SW3.A1 72.26,78.74 67.44,78.74 SW3.A2
  Bottom 0.254: U$4.5 68.71,67.44 68.71,77.34 SW3.A2
DIN7
  Top 0.254: U$4.4 82.42,78.61 87.63,78.61 SW4.A2 87.76,78.74 92.58,78.74 SW4.A1
DOUT9  (via drill 0.35)
  Top 0.254: R1.1 23.62,34.29 v36.7,34.29
  Bottom 0.254: v36.7,34.29 38.73,36.32 38.73,52.56 41.69,55.52 52.71,55.52 57.66,60.47 U$4.9
DOUT22
  Top 0.254: U$4.22/A8 70.23,48.64 22.35,48.64 20.83,47.12 20.83,41.15 20.32,40.64 17.53,40.64 16.76,39.88 16.76,15.49 18.16,14.1 R18.1
GND  (via drill 0.35)
  Top 0.254: IC11.10 42.35,57.32
  Top 0.356: C25.2 43.61,58.59 42.35,57.32
  Top 0.406: 45.47,58.55 43.81,58.55 C25.2 | 45.47,58.55 C23.2 | IC1.3 35.43,39.12 35.43,37.85 IC1.4 IC1.5 40.64,37.85 42.93,35.56 C12.2 | IC3.1 29.97,67.31 29.97,73.66 28.07,73.66 SW2.B2 | C5.- 32.89,59.18 26.92,59.18 26.8,59.31 IC4.1 | R50.1 47.24,63.75 47.75,63.25 47.75,59.44 46.86,58.55 45.47,58.55 | IC2.3 IC2.4 IC2.5 81.12,36.45 83.54,34.04 C11.2 | v61.47,93.55 65.08,93.55 v65.15,93.47 | v78.56,30.23 80.47,32.13 v80.7,32.13
  Top 0.61: SW4.B2 SW4.B1
  pour Bottom: 0,100.33 100.33,100.33 101.6,99.06 101.6,0 0,0
IN0  (via drill 0.35)
  Top 0.254: R17.1 33.66,43.31 35.31,41.66 IC1.1 28.19,41.66 C9.2 | U$4.14/A0 51.18,49.91 v36.83,49.91
  Bottom 0.254: R17.1 36.83,48.39 v36.83,49.91
IN1
  Top 0.254: IC1.7 42.55,40.39 43.56,39.37 45.21,39.37 46.99,41.15 46.99,43.18 | R9.1 46.99,43.18 | 46.99,43.18 C1.2
  Bottom 0.254: U$4.15/A1 55.12,49.28 52.07,46.23 C1.2
IN2
  Top 0.254: R32.1 70.36,42.93 C15.2
  Top 0.356: R32.1 75.12,40.7 IC2.1
  Bottom 0.254: C15.2 66.55,44.2 60.2,50.55 U$4.17/A3
IN3  (via drill 0.35)
  Top 0.254: R29.1 88.14,41.45 84.76,38.08 82.34,38.08 81.42,38.99 IC2.7 79.74,39.58 79.74,39.63 60.2,39.63 v60.2,41.4
  Bottom 0.254: C14.2 88.14,42.93 R29.1 | U$4.16/A2 57.66,48.77 60.2,46.23 v60.2,41.4
IN4
  Bottom 0.254: U$4.12 50.04,68.07 37.59,80.52 37.59,94.11 34.29,97.41 30.48,97.41 R6.P$2
IN5
  Bottom 0.254: U$4.11 52.58,70.1 50.8,71.88 R15.P$2
IN6
  Bottom 0.254: U$4.21/A7 70.36,52.58 71.37,53.59 73.41,53.59 90.17,70.36 R10.P$2
IN7
  Bottom 0.254: U$4.20/A6 67.82,55.63 69.21,57.02 69.21,95.26 R11.P$2
LEDOUT
  Bottom 0.254: U$4.8 60.2,72.76 63.55,76.11 63.55,94.52 66.25,97.22 93.77,97.22 96.52,94.47 96.52,62.03 J8.3
N$1
  Top 0.254: R1.2 13.08,31.37 T1.2
N$2
  Top 0.254: R3.2 R2.1 6.99,30.99 | T1.1 9.91,30.99 6.99,30.99 | 6.99,30.99 5.08,30.99 J1.P3
N$5
  Bottom 0.254: R8.2 54.61,41.4 53.34,40.13 53.34,32.38 J3.P3
N$6
  Bottom 0.254: R16.2 25.65,42.93 25.65,30.86 J13.P3
N$9
  Top 0.254: R8.1 53.34,38.1 C1.1 50.8,36.83 R7.1 R9.2 46.61,37.21 43.43,37.21 41.66,38.99 40.77,38.99 40.64,39.12 IC1.6
N$11
  Top 0.254: R16.1 25.4,38.1 C9.1 26.8,37.97 29.08,37.97 R23.1 31.37,35.69 R17.2 31.75,38.1 34.04,40.39 IC1.2
N$12
  Top 0.254: R18.2 13.08,16.13 T4.2
N$13
  Top 0.254: R20.2 R19.1 6.86,15.88 | T4.1 10.03,15.88 6.86,15.88 | J9.P3 6.86,15.88
N$16
  Top 0.254: R21.1 5.97,36.45 5.08,36.45 J14.P3
N$17
  Top 0.254: T5.2 17.53,42.93 18.03,42.93 R21.2
N$22
  Bottom 0.254: J4.P3 32.51,11.3 32.51,9.91 36.45,5.97 R47.1
N$28
  Top 0.254: 31.88,20.95 31.88,19.68 IC6.7 | 31.88,20.95 35.05,20.95 | 35.05,20.95 IC6.3 | 31.88,20.95 IC6.6 | 35.05,20.95 33.02,22.99 29.34,22.99 29.21,23.11 C28.2
N$29
  Top 0.254: IC6.5 31.75,22.23 31.62,22.1 26.92,22.1 24.64,24.38 R46.1 23.5,24.38 21.91,22.8 C27.1
N$30
  Top 0.254: R46.2 R45.1 27.94,16.76 29.21,18.03 C28.1
N$31
  Bottom 0.254: R28.2 94.61,43.05 J29.P3
N$32
  Top 0.254: R28.1 94.61,37.72 93.22,37.72 C14.1 91.95,36.58 R30.1 R29.2 82.55,36.58 81.28,37.85 80.45,37.85 IC2.6
N$34
  Bottom 0.254: R31.2 64.77,43.43 64.77,37.34 65.41,36.7 J32.P3
N$35
  Top 0.254: R31.1 65.28,37.85 C15.1 67.82,36.58 R33.1 R32.2 71.91,36.58 74.32,38.99 IC2.2
N$38
  Top 0.254: 52.2,20.95 52.2,19.68 IC7.7 | 52.2,20.95 55.37,20.95 | 55.37,20.95 IC7.3 | 52.2,20.95 IC7.6 | 55.37,20.95 53.34,22.99 49.66,22.99 49.53,23.11 C18.2
N$39
  Top 0.254: IC7.5 52.07,22.23 51.94,22.1 47.24,22.1 44.96,24.38 R36.1 43.81,24.38 42.29,22.86 C17.1
N$40
  Top 0.254: R36.2 R35.1 48.26,16.76 49.53,18.03 C18.1
N$41
  Top 0.254: IC7.2 58.42,19.68 59.44,18.67 R38.2 R39.2
N$42
  Top 0.254: R37.2 56.52,13.59 55.88,14.22 55.88,17.02 57.28,18.41 IC7.1
  Bottom 0.254: R38.1 56.9,8.38 56.9,13.59 R37.2
N$43  (via drill 0.35)
  Top 0.254: v38.61,19.05 37.72,19.05 37.08,19.68 IC6.2 | R48.2 R49.2
  Bottom 0.254: v38.61,19.05 39.12,18.54 R48.2
N$44  (via drill 0.35)
  Top 0.254: v35.81,17.27 36.96,18.41 IC6.1
  Bottom 0.254: v35.81,17.27 35.43,16.89 35.43,14.61 36.45,13.59 R47.2 36.58,13.59 36.58,8.38 R48.1
N$49
  Top 0.254: 71.37,21.08 71.37,19.81 IC8.7 | 71.37,21.08 74.55,21.08 | 74.55,21.08 IC8.3 | 71.37,21.08 IC8.6 | 74.55,21.08 72.64,22.99 68.96,22.99 68.71,23.24 C22.2
N$50
  Top 0.254: IC8.5 71.25,22.35 71.12,22.23 66.42,22.23 64.14,24.51 R41.1 62.99,24.51 61.47,22.99 C21.1
N$51
  Top 0.254: R41.2 R40.1 67.44,16.89 68.71,18.16 C22.1
N$52
  Top 0.254: IC8.2 76.58,19.81 77.22,19.18 77.85,19.18 78.61,18.41 R43.2 R44.2
N$53
  Top 0.254: R42.2 75.06,13.72 75.06,17.14 76.45,18.54 IC8.1
  Bottom 0.254: R43.1 76.07,8.51 76.07,13.72 R42.2
N$54
  Top 0.254: 91.19,21.08 91.19,19.81 IC9.7 | 91.19,21.08 94.36,21.08 | 94.36,21.08 IC9.3 | 91.19,21.08 IC9.6 | 94.36,21.08 92.33,23.11 88.65,23.11 88.52,23.24 C32.2
N$55
  Top 0.254: IC9.5 91.06,22.35 90.93,22.23 86.23,22.23 83.95,24.51 R52.1 82.8,24.51 81.28,22.99 C31.1
N$57
  Bottom 0.254: R4.1 7.37,56.26 7.37,53.72 J2.P3
N$58
  Top 0.254: R52.2 R51.1 87.25,16.89 88.52,18.16 C32.1
N$59
  Top 0.254: 97.73,19.11 98.04,18.8 R54.2 | 97.73,19.11 97.66,19.18 97.03,19.18 96.39,19.81 IC9.2 | R55.2 98.04,26.42 98.04,19.18 97.79,19.18 97.73,19.11
N$60
  Top 0.254: R53.2 94.87,13.72 94.87,17.14 96.27,18.54 IC9.1
  Bottom 0.254: R54.1 95.89,8.26 95.89,13.72 R53.2
N$66
  Bottom 0.254: T2.2 19.05,58.42 R4.2
RDY  (via drill 0.35)
  Top 0.254: v37.59,61.77 40.05,61.77 IC11.5
RX
  Top 0.254: U$4.0 81.84,67.87 91.95,67.87 J8.1
SCL
  Top 0.254: 41.78,64.9 41.78,67.69 41.15,68.33 R26.1 | 41.78,64.9 41.78,61.59 IC11.2 | U$4.19/A5 51.69,64.9 41.78,64.9
SDA  (via drill 0.35)
  Top 0.254: IC11.3 41.27,65.28 40.51,66.04 R25.1 | v52.32,58.67 55.37,58.67 U$4.18/A4
  Bottom 0.254: v52.32,58.67 45.72,58.67 R25.1
TX
  Top 0.254: U$4.1 81.89,62.64 94.74,62.64 94.72,62.66 J8.2
UNI_OUT1
  Bottom 0.254: J6.P3 69.85,12.19 75.95,6.1 R42.1
UNI_OUT2
  Bottom 0.254: J7.P3 92.46,11.05 92.46,9.4 95.76,6.1 R53.1
UNI_OUT3
  Bottom 0.254: R37.1 56.77,5.97 50.42,12.32 50.42,13.34 J5.P3
VCC
  Top 0.457: C3.+ 15.75,65.66 21.97,59.44 IC4.3 | IC9.8 91.06,18.54 91.06,16.51 C33.1 | IC8.8 71.25,18.54 71.25,16.51 C24.1 | IC7.8 52.07,18.41 52.07,16.38 C19.1 51.82,16.26 50.67,15.11 33.02,15.11 31.88,16.26 C29.1 | IC6.8 31.75,18.41 31.75,16.38 C29.1 | 20.7,15.11 20.7,13.72 R19.2 | 20.7,15.11 30.35,15.11 31.5,16.26 C29.1 | R2.2 20.7,24.89 20.7,15.11
  Bottom 0.457: C7.+ 16.76,78.49 D1.C 14.99,72.64 C3.+ 13.84,64.52 13.84,48.13 17.27,44.7 17.27,28.32 R2.2 | C19.1 52.07,16.26 52.07,15.11 66.17,15.11 67.44,16.38 71.12,16.38 C24.1 71.25,16.26 71.25,15.24 86.11,15.24 87.25,16.38 90.93,16.38 C33.1
VEE
  Top 0.457: IC9.4 96.27,22.35 96.27,24.26 C34.2 94.74,25.65 75.18,25.65 75.06,25.53 | IC8.4 76.45,22.35 76.45,24.26 C26.2 75.06,25.53 | IC6.4 36.96,22.23 36.96,24.13 C30.2 37.08,24.26 38.35,25.53 55.75,25.53 | IC7.4 57.28,22.23 57.28,24.13 C20.2 55.75,25.53 | 75.06,25.53 74.93,25.65 55.88,25.65 55.75,25.53
  Bottom 0.457: D2.A 16,92.33 16,89.41 C8.- 19.56,85.6 R14.1 19.56,63.5 21.84,61.21 21.84,24.89 25.4,21.34 34.04,21.34 C30.2

### Text on the board
tNames: RDY | • | • | • | • | • | •
bNames: RX | TX | LED OUT | pin 10 | pin13/LED | pin 23